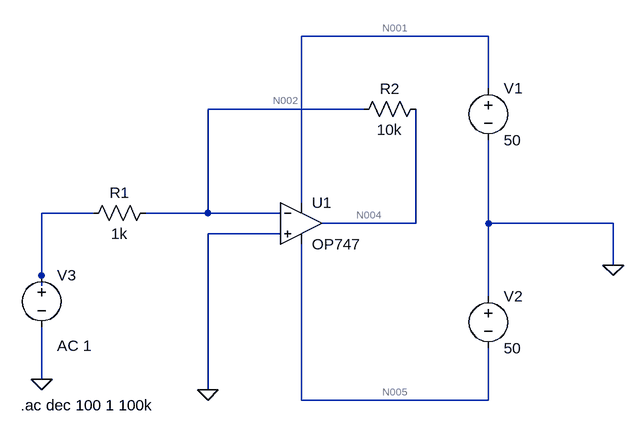
[diagram p0: schematic 1_Zadatak_Lab5.asc]
1_Zadatak_Lab5.asc, the LTspice schematic file:
Version 4
SHEET 1 880 680
WIRE 480 -144 192 -144
WIRE 480 -64 480 -144
WIRE 288 -32 48 -32
WIRE 192 112 192 -144
WIRE -128 128 -208 128
WIRE 48 128 48 -32
WIRE 48 128 -48 128
WIRE 160 128 48 128
WIRE 368 144 368 -32
WIRE 368 144 224 144
WIRE 480 144 480 16
WIRE 672 144 480 144
WIRE 160 160 48 160
WIRE 672 208 672 144
WIRE -208 224 -208 128
WIRE -208 240 -208 224
WIRE 480 256 480 144
WIRE -208 384 -208 304
WIRE 48 400 48 160
WIRE 192 416 192 176
WIRE 480 416 480 336
WIRE 480 416 192 416
FLAG 672 208 0
FLAG -208 384 0
FLAG 48 400 0
SYMBOL OpAmps\\OP747 192 80 R0
SYMATTR InstName U1
SYMBOL voltage 480 -80 R0
SYMATTR InstName V1
SYMATTR Value 50
SYMBOL voltage 480 240 R0
SYMATTR InstName V2
SYMATTR Value 50
SYMBOL res -32 112 R90
WINDOW 0 0 56 VBottom 2
WINDOW 3 32 56 VTop 2
SYMATTR InstName R1
SYMATTR Value 1k
SYMBOL res 384 -48 R90
WINDOW 0 0 56 VBottom 2
WINDOW 3 32 56 VTop 2
SYMATTR InstName R2
SYMATTR Value 10k
SYMBOL voltage -208 208 R0
WINDOW 123 24 124 Left 2
WINDOW 39 0 0 Left 0
SYMATTR Value2 AC 1
SYMATTR InstName V3
SYMATTR Value ""
TEXT -240 424 Left 2 !.ac dec 100 1 100k

The netlist it stands for:
* 1_Zadatak_Lab5.asc
XU1 0 N002 N001 N005 N004 OP747  ; pins In+ In- V+ V- OUT
V1 N001 0 50
V2 0 N005 50
R1 N002 N003 1k
R2 N004 N002 10k
V3 N003 0 AC 1
.ac dec 100 1 100k
.backanno
.end

* Results of the author's LTspice run, read from the files saved beside the schematic
* Operating Point, zero values left out:
*   V(n002) = 80 µV
*   V(n005) = -50 V
*   V(n001) = 50 V
*   V(n004) = 811 µV
*   I(R2) = 73.1 nA
*   I(R1) = 80 nA
*   I(V3) = 80 nA
*   I(V2) = -609.8 µA
*   I(V1) = -609.9 µA
*   Ix(u1:1) = -8.901 nA
*   Ix(u1:2) = -6.901 nA
*   Ix(u1:99) = 609.9 µA
*   Ix(u1:50) = -609.8 µA
*   Ix(u1:45) = -73.1 nA
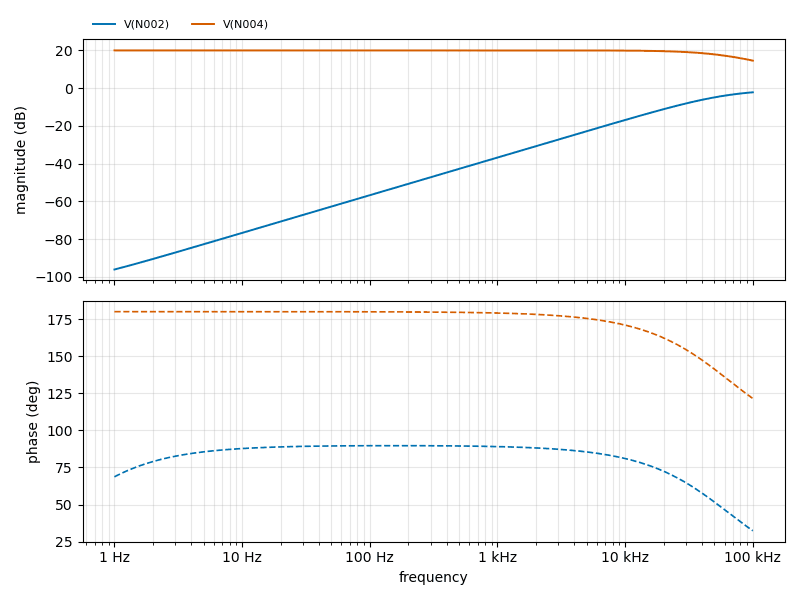
[diagram p1: AC Analysis of 1_Zadatak_Lab5.asc, plotted from the saved traces]
* AC Analysis, 1 run:
*   V(N002): -96.17 dB at 1 Hz, -2.21 dB at 100 kHz, peak -2.21 dB at 100 kHz, 3 dB below the peak at 47.19 kHz
*   V(N004): 20.00 dB at 1 Hz, 14.57 dB at 100 kHz, peak 20.00 dB at 1 Hz, 3 dB below the peak at 63.36 kHz